# EasyEDA Pro project ProPrj_trying to make a watch__2026-06-22.epro, board PCB1_7
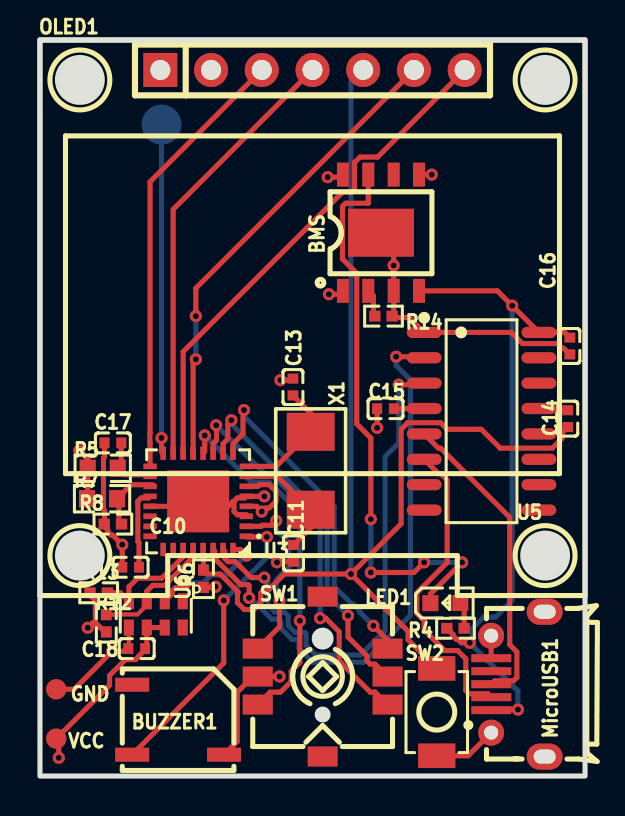
[diagram p2: board, top side]
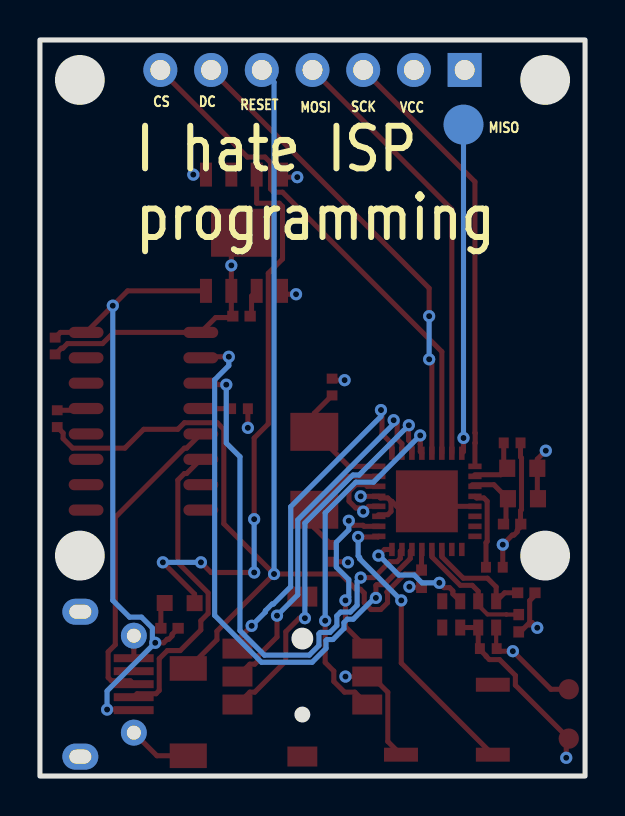
[diagram p3: board, bottom side, seen from below]

Outline 27.3 x 36.83 mm; copper layers: Top Layer, GND, VCC, Bottom Layer. Coordinates in mm from the lower left corner of the outline.
Outline path: rectangle 0,36.83 27.3,0
Stack: Top Layer 0.035mm Outer layer thickness 1oz / Dielectric1 0.2104mm 7628 RC49% 8.6mil / GND 0.0152mm Inner layer thickness / Dielectric2 1.065mm 1.1mm H/HOZ Copper / VCC 0.0152mm Inner layer thickness / Dielectric3 0.2104mm 7628 RC49% 8.6mil / Bottom Layer 0.035mm Outer layer thickness 1oz

## Design rules (mm)
spacing copperThickness1oz (default): track to track 0.102, other pairs 0.152 to 0.3
spacing copperThickness2oz: track to track 0.203, other pairs 0.152 to 0.3
spacing Plane_innerPlane: track to track 0.102, other pairs 0.152 to 0.3
spacing Copper_copperRegion: track to track 0.102, other pairs 0.152 to 0.3
track width copperThickness1oz (default): min 0.127, default 0.254, max 2.54
track width copperThickness2oz: min 0.203, default 0.254, max 2.54
differential pair differentialPair (default): width min 0.127, default 0.254, max 2.54; gap min 0.152, default 0.152
region e1 uses Copper_copperRegion
region e2 uses Copper_copperRegion
region e3 uses Copper_copperRegion
region e4 uses Copper_copperRegion
region e5 uses Copper_copperRegion
region e6 uses Copper_copperRegion
region e7 uses Copper_copperRegion
region e8 uses Copper_copperRegion
region e9 uses Copper_copperRegion
region e10 uses Copper_copperRegion
region e11 uses Copper_copperRegion
region e12 uses Copper_copperRegion
region e13 uses Copper_copperRegion
region e14 uses Copper_copperRegion
region e15 uses Copper_copperRegion
region e16 uses Copper_copperRegion
region e17 uses Copper_copperRegion
region e18 uses Copper_copperRegion
region e19 uses Copper_copperRegion
region e20 uses Copper_copperRegion
region e21 uses Copper_copperRegion
region e22 uses Copper_copperRegion
region e23 uses Copper_copperRegion
region e24 uses Copper_copperRegion

## Placement (name value [footprint] x y rotation side)
BMS  TP4056 (LX)  [ESOP-8_L4.9-W3.9-P1.27-LS6.0-BL-EP]  17.08 27.18 0 top
BUZZER1  4kHz  [BUZ-SMD_L5.0-W5.5-P4.60]  6.92 2.82 0 top
C10  100nF  [C0402]  4.54 10.45 180 top
C11  20pF  [C0402]  12.7 11.14 90 top
C13  20pF  [C0402]  12.67 19.46 270 top
C14  100nF  [C0402]  26.43 17.88 270 top
C15  100nF  [C0402]  17.31 18.38 0 top
C16  100nF  [C0402]  26.54 21.52 270 top
C17  100nF  [C0402]  3.65 16.67 0 top
C18  100nF  [C0402]  4.85 6.38 0 top
GND  -  [Test-Point-0.5mm]  0.82 4.34 0 top
LED1  XL-1608SURC-06  [LED0603-RD_RED]  20.3 8.65 0 top
MicroUSB1  MicroXNJ  [MICRO-USB-SMD_MICROXNJ_1]  23.94 4.6 90 top
NOREF  -  [Pad_e581]  6.09 32.59 0 top
OLED1  HS96L01W4S03  [OLED-TH_HS96L01W4S03]  13.65 35.33 0 top
R4  220Ω  [R0402]  20.81 7.39 0 top
R5  10Ω  [R0603]  3.14 15.4 0 top
R6  10kΩ  [R0402]  8.19 9.87 90 top
R7  300kΩ  [R0603]  3.11 13.88 180 top
R8  100kΩ  [R0402]  3.65 12.61 0 top
R12  4.7kΩ  [R0402]  3.32 7.64 90 top
R13  4.7kΩ  [R0402]  2.94 9.17 0 top
R14  10kΩ  [R0402]  17.21 23.01 180 top
SW1  7*7*5-6P-L WX  [SW-SMD_8P-L7.0-W7.0-P1.40-LS7.4-TL]  14.16 4.98 0 top
SW2  TS-1088-AR02016  [SW-SMD_L3.9-W3.0-P4.45]  19.87 3.2 270 top
U3  ATMEGA328P-MU  [HVQFN-32_L5.0-W5.0-P0.50-TL-EP3.1]  7.92 13.74 180 top
U5  CH340C  [SOP-16_L10.0-W3.9-P1.27-LS6.0-BL]  22.12 17.75 270 top
U6  RV-3028-C7-32.768kHz-1ppm-TA-QC  [OSC-SMD_8P-L3.2-W1.5-P0.90-BL]  5.8 8.09 180 top
VCC  -  [Test-Point-0.5mm]  0.82 1.87 0 top
X1  16MHz  [OSC-SMD_2P-L5.0-W3.2]  13.56 15.27 270 top

## Footprints (pads in the part's own frame, mm; a bottom-side part is the same pattern mirrored in y, then rotated)
BUZ-SMD_L5.0-W5.5-P4.60
  rect 1.7x0.7 smd: 1(-2.3,-1.75) 2(2.3,-1.75) 3(-2.3,1.75)
C0402
  rect 0.5x0.54 smd: 1(-0.42,0) 2(0.42,0)
ESOP-8_L4.9-W3.9-P1.27-LS6.0-BL-EP
  rect 0.6x1.2 smd: 1(-1.905,-2.909) 2(-0.635,-2.909) 3(0.635,-2.909) 4(1.905,-2.909) 5(1.905,2.909) 6(0.635,2.909) 7(-0.635,2.909) 8(-1.905,2.909)
  rect 3.3x2.4 smd: 9(0,0)
HVQFN-32_L5.0-W5.0-P0.50-TL-EP3.1
  rect 0.665x0.28 smd: 1(-2.408,1.75) 2(-2.408,1.25) 3(-2.408,0.75) 4(-2.408,0.25) 5(-2.408,-0.25) 6(-2.408,-0.75) 7(-2.408,-1.25) 8(-2.408,-1.75) 17(2.408,-1.75) 18(2.408,-1.25) 19(2.408,-0.75) 20(2.408,-0.25) 21(2.408,0.25) 22(2.408,0.75) 23(2.408,1.25) 24(2.408,1.75)
  rect 0.28x0.665 smd: 9(-1.75,-2.408) 10(-1.25,-2.408) 11(-0.75,-2.408) 12(-0.25,-2.408) 13(0.25,-2.408) 14(0.75,-2.408) 15(1.25,-2.408) 16(1.75,-2.408) 25(1.75,2.408) 26(1.25,2.408) 27(0.75,2.408) 28(0.25,2.408) 29(-0.25,2.408) 30(-0.75,2.408) 31(-1.25,2.408) 32(-1.75,2.408)
  rect 3.1x3.1 smd: 33(0,0)
LED0603-RD_RED
  rect 0.8x0.8 smd: 1(-0.749,-0.004) 2(0.749,0.004)
MICRO-USB-SMD_MICROXNJ_1
  rect 0.4x2 smd: 1(-1.3,1.332) 2(-0.65,1.332) 3(0,1.332) 4(0.65,1.332) 5(1.3,1.332)
  round 1.3 hole 0.7: 6(2.425,1.34) 9(-2.425,1.34)
  oval 1.3x1.8 hole 0.7x1.1: 7(3.625,-1.34) 8(-3.625,-1.34)
OLED-TH_HS96L01W4S03
  rect 1.7x1.7 hole 1: 1(-7.62,0)
  round 1.7 hole 1: 2(-5.08,0) 3(-2.54,0) 4(0,0) 5(2.54,0) 6(5.08,0) 7(7.62,0)
OSC-SMD_2P-L5.0-W3.2
  rect 1.9x2.4 smd: 1(-1.95,0) 2(1.95,0)
OSC-SMD_8P-L3.2-W1.5-P0.90-BL
  rect 0.504x0.8 smd: 1(-1.35,-0.657) 2(-0.45,-0.657) 3(0.45,-0.657) 4(1.35,-0.657) 5(1.35,0.657) 6(0.45,0.657) 7(-0.45,0.657) 8(-1.35,0.657)
Pad_e581
  round 2 smd far side: 1(0,0)
R0402
  rect 0.566x0.54 smd: 1(-0.433,0) 2(0.433,0)
R0603
  rect 0.806x0.864 smd: 1(-0.753,0) 2(0.753,0)
SOP-16_L10.0-W3.9-P1.27-LS6.0-BL
  oval 0.56x1.745 smd: 1(-4.445,-2.873) 2(-3.175,-2.873) 3(-1.905,-2.873) 4(-0.635,-2.873) 5(0.635,-2.873) 6(1.905,-2.873) 7(3.175,-2.873) 8(4.445,-2.873) 9(4.445,2.873) 10(3.175,2.873) 11(1.905,2.873) 12(0.635,2.873) 13(-0.635,2.873) 14(-1.905,2.873) 15(-3.175,2.873) 16(-4.445,2.873)
SW-SMD_8P-L7.0-W7.0-P1.40-LS7.4-TL
  rect 1.5x1 smd: 1(-3.25,1.4) 2(-3.25,0) 3(-3.25,-1.4) 4(3.25,-1.4) 5(3.25,0) 6(3.25,1.4) 7(0,4) 8(0,-4)
SW-SMD_L3.9-W3.0-P4.45
  rect 1.23x1.86 smd: 1(-2.185,0) 2(2.185,0)
Test-Point-0.5mm
  round 1.016 smd: 1(0,0)

## Nets
As in the schematic, except:
MISO: NOREF.1 U3.16

Pads without a net: BMS 6; BUZZER1 3; MicroUSB1 4; SW1 7 8; U5 7 8 9 10 11 12 14 15; U6 1 8

## Via types
v1: diameter 0.61, hole 0.305, Top Layer to Bottom Layer, 45 vias

## Routing (per net, layer and track width the routed paths; a pad name or vN(x,y) marks a point on that pad's centre or on a via; arc(x,y) is an arc through that point)
+5V: length 33.8
  Top Layer w0.254: R4.1 20.68,7.09 20.68,7.01 20.85,6.84 20.93,6.84 21.11,6.67 v1(21.53,6.67) ; BMS.4 22.91,24.28 v1(23.65,23.53) U5.16 26.28,22.2 C16.1 ; MicroUSB1.1 22.63,3.33 v1(23.94,3.33)
  Bottom Layer w0.254: v1(23.94,3.33) 23.94,4.26 v1(21.53,6.67) 21.67,6.81 21.67,7.41 22.21,7.95 22.81,7.95 23.65,8.79 v1(23.65,23.53)
AVCC: length 3.1
  Top Layer w0.254: C17.2 4.07,15.57 R5.2 4.22,15.08 5.52,15.08
GND: length 46.3
  Top Layer w0.21: C18.1 4.45,6.4 U6.5
  Top Layer w0.254: 9.68,13.74 9.72,13.71 9.72,13.24 9.88,13.08 10.35,13.08 ; 9.68,13.74 9.42,13.49 7.79,13.49 7.79,13.49 U3.21 ; 9.68,13.74 9.71,13.74 9.88,13.91 10.25,13.91 10.33,13.99 v1(11.24,13.99) ; C17.1 3.23,15.96 3.18,15.91 3.18,13.33 3.23,13.28 3.23,12.75 3.09,12.61 3.4,12.3 3.4,12.22 3.56,12.06 3.64,12.06 v1(4.12,11.58) 4.12,10.45 ; 17.08,27.31 17.71,26.68 v1(17.71,25.55) 17.71,24.4 ; C15.1 v1(16.89,17.42) ; C16.2 26.23,21.41 26.15,21.41 25.92,21.64 24.16,21.64 23.6,22.2 U5.1 18.5,22.94 17.57,22.94 ; C11.1 11.9,10.72 v1(11.87,10.69) ; C18.1 4.3,6.25 v1(3.62,6.25) 1.71,4.34 GND.1 ; MicroUSB1.6 22.6,5.9 22.6,5.9 ; v1(12,4.98) SW1.2 10.66,4.98 9.88,4.19 9.88,1.73 BUZZER1.2 ; v1(12.04,19.81) 12.59,19.81 C13.1 ; BMS.3 17.71,23.21 17.57,23.07 ; SW2.2 21.44,1.01 MicroUSB1.9
VCC: length 21.9
  Top Layer w0.254: BMS.5 v1(19.62,30.09) ; R6.1 8.77,9.44 v1(8.8,9.47) ; v1(14.47,24.11) 15.01,24.11 BMS.1 ; v1(0.94,0.91) 0.94,1.74 VCC.1 3.49,4.55 3.49,5.03 4.28,5.83 4.79,5.83 4.96,5.99 4.96,6.01 5.27,6.32 C18.2 5.35,6.46 U6.6 U6.7 ; U3.6 10.91,14.49 10.99,14.58 11.48,14.58 11.82,14.24 11.82,13.75 11.48,13.41 11.29,13.41 v1(11.11,13.23) 10.85,13.49 U3.4 ; 2.77,7.68 3.24,7.21 R12.1 ; 2.77,7.68 2.77,7.55 ; 2.77,7.68 2.77,8.78 2.51,9.04 ; 2.77,7.68 2.65,7.68 v1(2.39,7.42) ; 2.36,13.88 2.39,13.91 R5.1 2.39,15.85 v1(1.97,16.28) ; BMS.8 15.05,29.97 v1(14.41,29.97)
ADC6: length 3.4
  Top Layer w0.254: 3.96,12.61 3.96,13.78 R7.1 4.56,14.57 5.65,14.57
AREF: length 4
  Top Layer w0.254: C10.1 4.96,11.68 4.9,11.74 4.9,13.75 5.07,13.91 5.43,13.91 5.51,13.99
BAT-LED: length 29.2
  Top Layer w0.254: v1(16.57,10.18) 18.73,10.18 v1(19.24,10.69) ; v1(21.14,10.69) 19.55,9.1 LED1.1 ; v1(16.57,12.85) 16.57,16.91 15.87,17.62 15.87,25.15 15.15,25.87 15.15,28.5 15.31,28.66 16.44,28.66 BMS.7
  Bottom Layer w0.254: v1(16.57,12.85) v1(16.57,10.18) ; v1(19.24,10.69) v1(21.14,10.69)
CS: length 25.8
  Top Layer w0.254: U3.14 7.17,21.23 15.15,29.21 15.59,29.21 15.75,29.38 15.75,30.7 16.03,30.97 16.91,30.97 OLED1.7
D+: length 15.6
  Top Layer w0.254: U5.5 19.95,16.41 20.07,16.41 23.53,12.95 23.53,6.57 23.88,6.21 23.88,4.93 23.72,4.77 22.78,4.77 MicroUSB1.3
D-: length 15.6
  Top Layer w0.254: MicroUSB1.2 22.43,4.12 21.49,4.12 21.33,4.28 21.33,5.87 20.92,6.28 20.27,6.28 19.24,7.31 19.24,7.77 18.88,8.13 18.88,9.17 20.39,10.68 20.39,14.81 20.07,15.14 19.95,15.14 U5.6
DC: length 23.8
  Top Layer w0.254: U3.13 7.67,20.72 v1(7.81,20.85) ; v1(7.81,23.01) 7.81,24.41 OLED1.6
  Bottom Layer w0.254: v1(7.81,23.01) v1(7.81,20.85)
MISO: length 16.6
  Top Layer w0.254: U3.16 6.09,16.24 v1(6.09,16.91)
  Bottom Layer w0.254: 6.16,32.66 NOREF.1 v1(6.09,16.91)
MOSI: length 22.1
  Top Layer w0.254: OLED1.4 6.67,28.35 U3.15
PIN2: length 5.9
  Top Layer w0.254: U3.32 10.04,11.34 v1(10.35,11.03) ; v1(7.3,9.67) 7.06,9.42 6.78,9.42 6.62,9.26 6.62,9.11 U6.2
  Bottom Layer w0.254: 10.35,11.07 9.33,10.05 8.56,10.05 8.17,9.67 v1(7.3,9.67)
PIN3: length 14.7
  Top Layer w0.254: 10.33,11.99 10.36,11.96 v1(11.36,11.96) ; BUZZER1.1 9.2,5.65 v1(9.2,8.79)
  Bottom Layer w0.254: v1(9.2,8.79) 11.29,10.87 11.29,10.93 11.36,11.01 v1(11.36,11.96)
PIN4: length 9.1
  Top Layer w0.254: v1(12,8.79) 12,7.47 SW1.1 ; U3.2 11.07,12.49 11.12,12.55 11.6,12.55 v1(11.83,12.77)
  Bottom Layer w0.254: v1(11.83,12.77) 11.83,12.32 12.46,11.7 12.46,10.45 11.83,9.83 11.83,8.95 v1(12,8.79)
PIN5: length 17.3
  Top Layer w0.254: U3.9 9.67,16.62 10.17,17.12 10.17,18.26 v1(10.22,18.31) ; SW1.6 17.41,6.81 v1(16.7,7.52)
  Bottom Layer w0.254: v1(16.7,7.52) 16.01,8.2 16.01,8.27 15.67,8.61 15.61,8.61 14.74,9.47 14.74,13.47 10.22,17.99 v1(10.22,18.31)
PIN6: length 18
  Top Layer w0.254: v1(15.43,8.02) 15.43,6.96 16.38,6.01 16.38,5.76 16.54,5.6 16.79,5.6 SW1.5 ; v1(9.59,17.8) 9.41,17.63 9.41,16.87 9.17,16.63 U3.10
  Bottom Layer w0.254: v1(9.59,17.8) 9.59,17.62 14.39,12.82 14.39,9.07 v1(15.43,8.02)
PIN7: length 19.5
  Top Layer w0.254: SW1.4 16.79,4.2 16.54,4.2 14.99,5.75 14.99,7.22 14.31,7.9 v1(14.03,7.9) ; v1(8.83,17.55) 8.84,17.54 8.84,16.8 8.67,16.63 U3.11
  Bottom Layer w0.254: v1(14.03,7.9) 14.03,12.66 11.63,15.06 11.32,15.06 v1(8.83,17.55)
PIN8: length 18.1
  Top Layer w0.254: v1(13.01,7.77) 13.01,5.68 12.58,5.25 12.58,4.73 12.05,4.2 11.53,4.2 SW1.3 ; v1(8.26,17.04) 8.26,16.6 8.25,16.6 8.25,16.23 U3.12
  Bottom Layer w0.254: v1(8.26,17.04) 10.59,14.7 11.48,14.7 13.01,13.17 v1(13.01,7.77)
PROG: length 1.3
  Top Layer w0.254: BMS.2 16.7,24.02 16.7,23.07
RESET: length 60.5
  Top Layer w0.254: v1(15.58,10.11) 18.09,12.62 18.09,17.35 18.42,17.68 20.07,17.68 20.39,17.35 22.1,17.35 23.05,16.41 25.66,16.41 26.14,16.89 26.14,17.17 C14.2 ; v1(15.58,10.11) 18.44,7.25 18.44,6.82 SW2.1 ; v1(15.58,10.11) 12.24,10.11 11.48,9.35 11.25,9.35 11.06,9.16 11.06,8.67 10.72,8.33 10.23,8.33 9.89,8.67 9.89,9.16 9.92,9.18 9.92,9.22 9.03,10.11 8.39,10.11 R6.2 8.19,11.32 U3.29
  Bottom Layer w0.254: v1(15.58,10.11) 15.58,34.72 16.19,35.33
RXD: length 28.8
  Top Layer w0.254: U5.2 19.19,20.98 v1(17.84,20.98) ; U3.30 8.75,11.26 8.75,10.89 10.06,9.57 10.43,9.57 10.47,9.53 v1(10.47,8.91)
  Bottom Layer w0.254: v1(10.47,8.91) 10.54,8.91 11.61,7.85 11.9,7.85 12.07,7.68 12.07,7.38 12.63,6.83 12.92,6.83 12.97,6.78 12.97,6.39 13.67,5.69 16.2,5.69 18.55,8.04 18.55,19.82 17.84,20.53 v1(17.84,20.98)
SCK: length 22.2
  Top Layer w0.254: U3.17 5.51,16.66 5.5,16.67 5.5,17.16 5.51,17.17 5.51,29.73 OLED1.3
SCL: length 6.3
  Top Layer w0.21: U6.3 5.35,8.55 4.89,8.09 3.94,8.09 3.94,8.08 3.32,8.08
  Top Layer w0.254: U6.3 5.35,9.24 5.65,9.54 6.25,9.54 7.67,10.97 U3.28
SDA: length 5.7
  Top Layer w0.254: R13.2 4.03,9.17 U6.4 4.45,9.46 4.89,9.9 6.1,9.9 7.17,10.97 U3.27
TXD: length 26.3
  Top Layer w0.254: U5.3 19.17,19.58 v1(17.97,19.58) ; v1(11.24,9.93) 10.58,9.93 9.78,10.73 9.42,10.73 9.25,10.89 9.25,11.26 U3.31
  Bottom Layer w0.254: v1(17.97,19.58) 17.97,16.66 17.28,15.97 17.28,7.27 16.05,6.05 13.81,6.05 13.33,6.53 13.33,7.11 13.26,7.19 12.77,7.19 12.43,7.53 12.43,8.01 12.24,8.2 11.76,8.2 11.41,8.54 11.41,9.75 v1(11.24,9.93)
XTAL1: length 6
  Top Layer w0.254: 10.33,14.99 11.89,14.99 X1.2 13.56,12.42 C11.2
XTAL2: length 6.1
  Top Layer w0.254: U3.8 11.83,15.49 X1.1 13.56,18.15 12.67,19.04
$1N13873: length 1.5
  Top Layer w0.254: LED1.2 21.24,8.47 21.24,7.27
$1N25972: length 1.5
  Top Layer w0.254: C14.1 25.07,18.3 U5.13
$1N26008: length 1.5
  Top Layer w0.254: C15.2 19.24,18.38 U5.4

## Copper pours and planes (outline as drawn; the poured copper is in the pictures)
GND on GND: 0.26,36.57 27.04,36.57 27.04,0.26 0.26,0.26
VCC on VCC: 0.26,36.57 27.04,36.57 27.04,0.26 0.26,0.26

Small or netless copper shapes (teardrops, artwork), in the pictures only: 18 on GND, 4 on VCC

## Text on the board
Bottom Silkscreen Layer: MISO | VCC | SCK | MOSI | RESET | DC | CS | I hate ISP / programming
